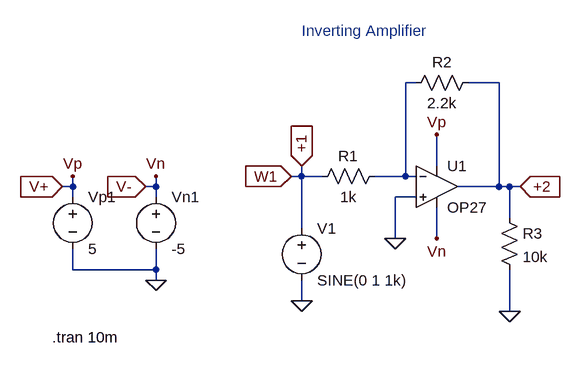
[diagram p0: schematic inv_amp.asc]
inv_amp.asc, the LTspice schematic file:
Version 4
SHEET 1 880 680
WIRE 272 32 256 32
WIRE 400 32 352 32
WIRE 304 160 304 112
WIRE 96 176 96 160
WIRE 96 176 80 176
WIRE 128 176 96 176
WIRE 256 176 256 32
WIRE 256 176 208 176
WIRE 272 176 256 176
WIRE -256 192 -256 176
WIRE -256 192 -272 192
WIRE -128 192 -128 176
WIRE -128 192 -144 192
WIRE 400 192 400 32
WIRE 400 192 336 192
WIRE 416 192 400 192
WIRE 432 192 416 192
WIRE -256 208 -256 192
WIRE -128 208 -128 192
WIRE 272 208 240 208
WIRE 416 240 416 192
WIRE 96 256 96 176
WIRE 240 272 240 208
WIRE 304 272 304 224
WIRE -256 320 -256 288
WIRE -128 320 -128 288
WIRE -128 320 -256 320
WIRE -128 336 -128 320
WIRE 96 368 96 336
WIRE 416 384 416 320
FLAG 96 368 0
FLAG 304 272 Vn
FLAG 304 112 Vp
FLAG 416 384 0
FLAG 240 272 0
FLAG 80 176 W1
IOPIN 80 176 In
FLAG 96 160 +1
IOPIN 96 160 In
FLAG 432 192 +2
IOPIN 432 192 In
FLAG -128 336 0
FLAG -256 176 Vp
FLAG -128 176 Vn
FLAG -272 192 V+
IOPIN -272 192 In
FLAG -144 192 V-
IOPIN -144 192 In
SYMBOL voltage 96 240 R0
WINDOW 123 0 0 Left 0
WINDOW 39 0 0 Left 0
SYMATTR InstName V1
SYMATTR Value SINE(0 1 1k)
SYMBOL res 224 160 R90
WINDOW 0 0 56 VBottom 2
WINDOW 3 32 56 VTop 2
SYMATTR InstName R1
SYMATTR Value 1k
SYMBOL res 368 16 R90
WINDOW 0 0 56 VBottom 2
WINDOW 3 32 56 VTop 2
SYMATTR InstName R2
SYMATTR Value 2.2k
SYMBOL res 400 224 R0
SYMATTR InstName R3
SYMATTR Value 10k
SYMBOL Opamps\\OP27 304 128 R0
SYMATTR InstName U1
SYMBOL voltage -256 192 R0
WINDOW 123 0 0 Left 0
WINDOW 39 0 0 Left 0
SYMATTR InstName Vp1
SYMATTR Value 5
SYMBOL voltage -128 192 R0
WINDOW 123 0 0 Left 0
WINDOW 39 0 0 Left 0
SYMATTR InstName Vn1
SYMATTR Value -5
TEXT 96 -48 Left 2 ;Inverting Amplifier
TEXT -288 424 Left 2 !.tran 10m

The netlist it stands for:
* inv_amp.asc
V1 +1 0 SINE(0 1 1k)
R1 N001 +1 1k
R2 +2 N001 2.2k
R3 +2 0 10k
XU1 0 N001 V+ V- +2 OP27  ; pins In+ In- V+ V- OUT
Vp1 V+ 0 5
Vn1 V- 0 -5
* Inverting Amplifier
.tran 10m
.lib ADI.lib
.backanno
.end